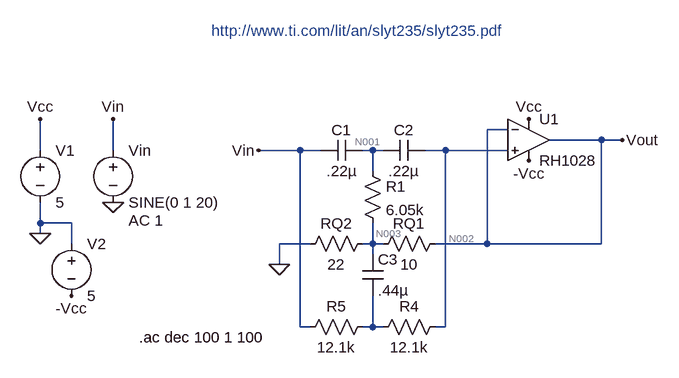
[diagram p0: schematic TwinTNotchwOpAmpv4.asc]
TwinTNotchwOpAmpv4.asc, the LTspice schematic file:
Version 4
SHEET 1 880 680
WIRE 384 112 352 112
WIRE 528 128 448 128
WIRE 560 128 528 128
WIRE -336 144 -336 96
WIRE -224 144 -224 96
WIRE 64 144 0 144
WIRE 96 144 64 144
WIRE 176 144 160 144
WIRE 192 144 176 144
WIRE 288 144 256 144
WIRE 384 144 288 144
WIRE 176 176 176 144
WIRE -336 256 -336 224
WIRE -288 256 -336 256
WIRE -336 272 -336 256
WIRE -288 288 -288 256
WIRE 80 288 32 288
WIRE 176 288 176 256
WIRE 176 288 160 288
WIRE 192 288 176 288
WIRE 352 288 352 112
WIRE 352 288 272 288
WIRE 528 288 528 128
WIRE 528 288 352 288
WIRE 176 304 176 288
WIRE 32 320 32 288
WIRE 64 416 64 144
WIRE 80 416 64 416
WIRE 176 416 176 368
WIRE 176 416 160 416
WIRE 192 416 176 416
WIRE 288 416 288 144
WIRE 288 416 272 416
FLAG 0 144 Vin
FLAG -224 224 0
FLAG -224 96 Vin
FLAG -336 96 Vcc
FLAG 416 96 Vcc
FLAG -336 272 0
FLAG -288 368 -Vcc
FLAG 416 160 -Vcc
FLAG 32 320 0
FLAG 560 128 Vout
SYMBOL voltage -224 128 R0
WINDOW 123 24 124 Left 2
WINDOW 39 0 0 Left 2
SYMATTR Value2 AC 1
SYMATTR InstName Vin
SYMATTR Value SINE(0 1 20)
SYMBOL Opamps\\RH1028 416 64 R0
SYMATTR InstName U1
SYMBOL voltage -336 128 R0
WINDOW 123 0 0 Left 2
WINDOW 39 0 0 Left 2
SYMATTR InstName V1
SYMATTR Value 5
SYMBOL voltage -288 272 R0
WINDOW 123 0 0 Left 2
WINDOW 39 0 0 Left 2
SYMATTR InstName V2
SYMATTR Value 5
SYMBOL cap 160 128 R90
WINDOW 0 0 32 VBottom 2
WINDOW 3 32 32 VTop 2
SYMATTR InstName C1
SYMATTR Value .22µ
SYMBOL cap 256 128 R90
WINDOW 0 0 32 VBottom 2
WINDOW 3 32 32 VTop 2
SYMATTR InstName C2
SYMATTR Value .22µ
SYMBOL res 160 160 R0
SYMATTR InstName R1
SYMATTR Value 6.05k
SYMBOL res 288 272 R90
WINDOW 0 0 56 VBottom 2
WINDOW 3 32 56 VTop 2
SYMATTR InstName RQ1
SYMATTR Value 10
SYMBOL res 176 272 R90
WINDOW 0 0 56 VBottom 2
WINDOW 3 32 56 VTop 2
SYMATTR InstName RQ2
SYMATTR Value 22
SYMBOL cap 160 304 R0
SYMATTR InstName C3
SYMATTR Value .44µ
SYMBOL res 288 400 R90
WINDOW 0 0 56 VBottom 2
WINDOW 3 32 56 VTop 2
SYMATTR InstName R4
SYMATTR Value 12.1k
SYMBOL res 176 400 R90
WINDOW 0 0 56 VBottom 2
WINDOW 3 32 56 VTop 2
SYMATTR InstName R5
SYMATTR Value 12.1k
TEXT -184 432 Left 2 !.ac dec 100 1 100
TEXT -72 -40 Left 2 ;http://www.ti.com/lit/an/slyt235/slyt235.pdf

The netlist it stands for:
* TwinTNotchwOpAmpv4.asc
Vin Vin 0 SINE(0 1 20) AC 1
XU1 N002 Vout Vcc -Vcc Vout RH1028  ; pins In+ In- V+ V- OUT
V1 Vcc 0 5
V2 0 -Vcc 5
C1 N001 Vin .22µ
C2 N002 N001 .22µ
R1 N001 N003 6.05k
RQ1 Vout N003 10
RQ2 N003 0 22
C3 N003 N004 .44µ
R4 N002 N004 12.1k
R5 N004 Vin 12.1k
.ac dec 100 1 100
* http://www.ti.com/lit/an/slyt235/slyt235.pdf
.backanno
.end

* Results of the author's LTspice run, read from the files saved beside the schematic
* Operating Point, zero values left out:
*   V(vcc) = 5 V
*   V(-vcc) = -5 V
*   I(V2) = -6.699 mA
*   I(V1) = -6.699 mA
*   Ix(u1:3) = 6.699 mA
*   Ix(u1:4) = -6.699 mA
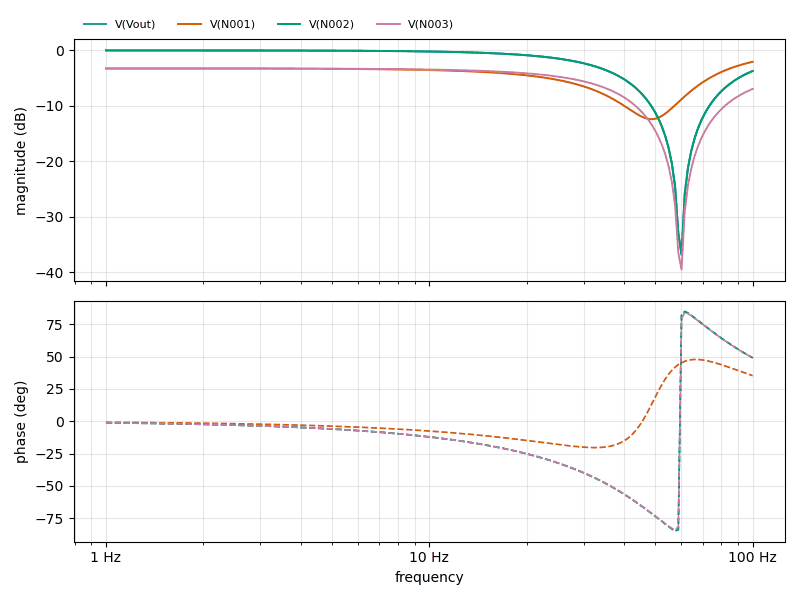
[diagram p1: AC Analysis of TwinTNotchwOpAmpv4.asc, plotted from the saved traces]
* AC Analysis, 1 run:
*   V(Vout): -0.00 dB at 1 Hz, -3.71 dB at 100 Hz, peak -0.00 dB at 1 Hz, 3 dB below the peak at 33.09 Hz
*   V(N001): -3.26 dB at 1 Hz, -2.06 dB at 100 Hz, peak -2.06 dB at 100 Hz, 3 dB below the peak at 73.15 Hz
*   V(N002): -0.00 dB at 1 Hz, -3.71 dB at 100 Hz, peak -0.00 dB at 1 Hz, 3 dB below the peak at 33.09 Hz
*   V(N003): -3.26 dB at 1 Hz, -6.95 dB at 100 Hz, peak -3.26 dB at 1 Hz, 3 dB below the peak at 33.08 Hz